# Altium schematic sheet 3-camera.SchDoc
size A4; SheetNumber: 3; SheetTotal: 4
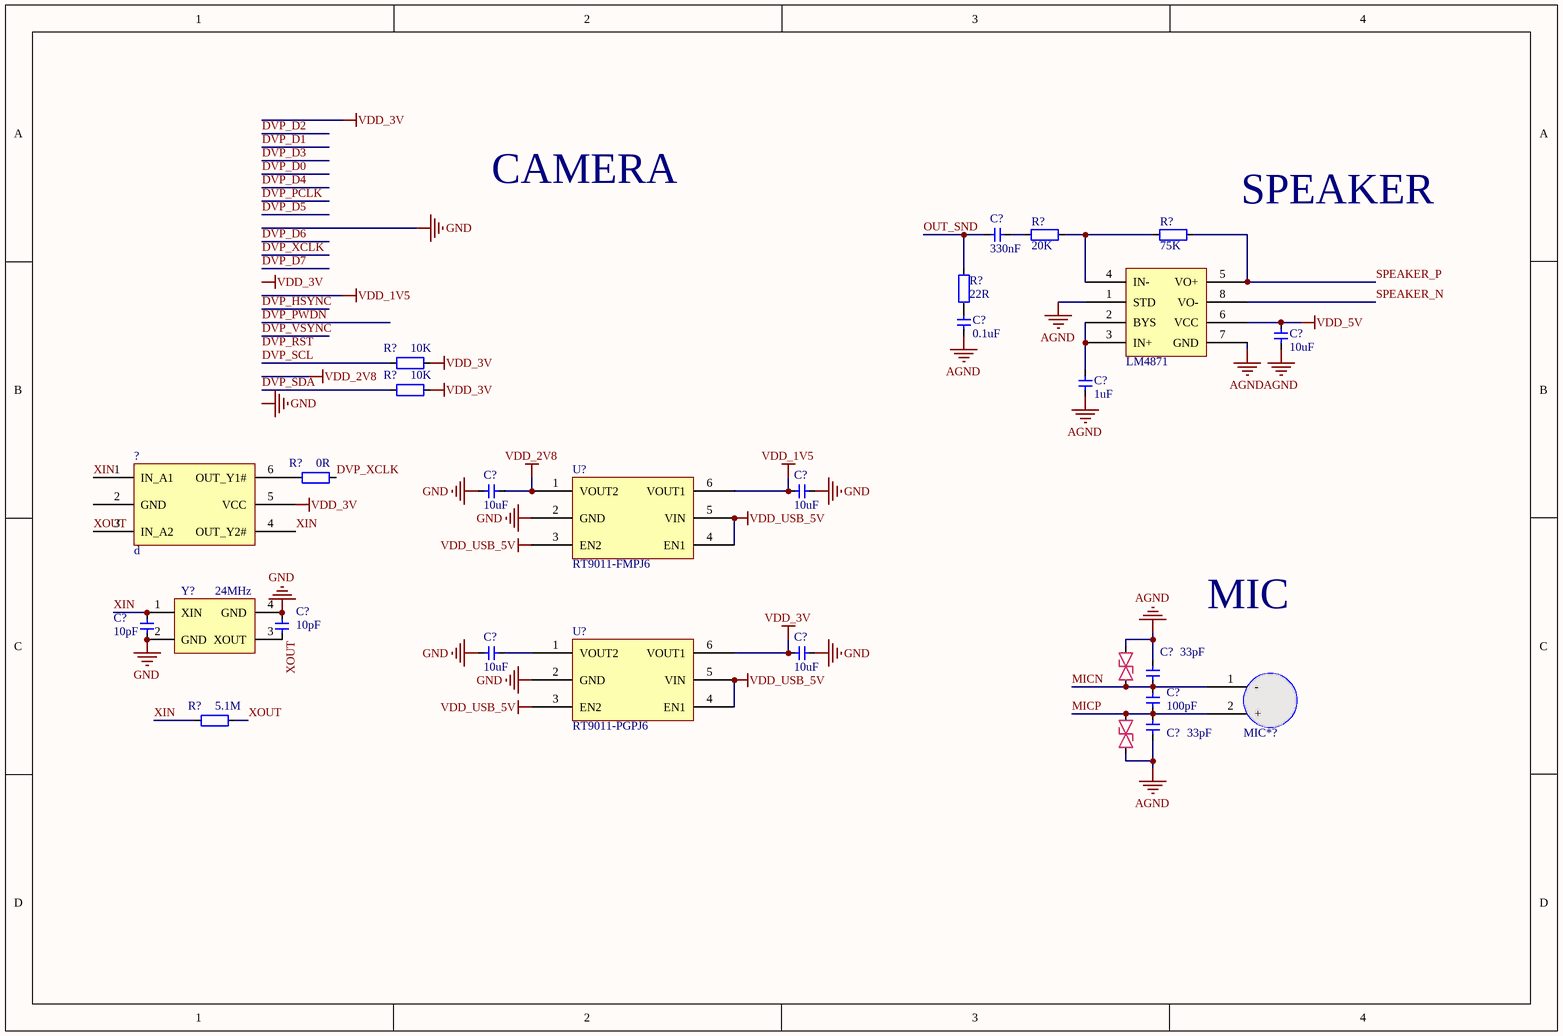
[diagram p0: 3-camera.SchDoc]

## Parts
(Parts that share a designator on the sheet are numbered #1, #2 ... from top to bottom, then left to right.)
*?  LM4871  [MSOP-8]
?  d  [SOT363-6]
C?#1  330nF  [0603-CAP]
C?#2  0.1uF  [CAP_0402]
C?#3  10uF  [CAP_0402]
C?#4  1uF  [CAP_0402]
C?#5  10uF  [CAP_0402]
C?#6  10uF  [CAP_0402]
C?#7  10pF  [CAP_0402]
C?#8  10pF  [CAP_0402]
C?#9  10uF  [CAP_0402]
C?#10  10uF  [CAP_0402]
C?#11  33pF  [CAP_0402]
C?#12  100pF  [CAP_0402]
C?#13  33pF  [CAP_0402]
ESD-?#1  ESD-0402  [ESD-0402]  (value not drawn)
ESD-?#2  ESD-0402  [ESD-0402]  (value not drawn)
MIC*?  MIC*  [MIC-0416]  (value not drawn)
R?#1  20K  [RES_0402]
R?#2  75K  [RES_0402]
R?#3  22R  [RES_0402]
R?#4  10K  [RES_0402]
R?#5  10K  [RES_0402]
R?#6  0R  [RES_0402]
R?#7  5.1M  [RES_0402]
U?#1  RT9011-FMPJ6  [SOT23-6]
U?#2  RT9011-PGPJ6  [SOT23-6]
Y?  24MHz  [晶振2520]

## Nets
AGND: *?.1(STD) *?.7(GND) C?#2.1 C?#3.1 C?#4.1 C?#11.1 C?#13.1 ESD-?#1.2 ESD-?#2.1
GND: C?#5.1 C?#6.1 C?#7.1 C?#8.2 C?#9.1 C?#10.1 U?#1.2(GND) U?#2.2(GND) Y?.2(GND) Y?.4(GND)
VDD_1V5: C?#6.2 U?#1.6(VOUT1)
VDD_2V8: C?#5.2 U?#1.1(VOUT2)
VDD_3V: ?.5(VCC) C?#10.2 R?#4.2 R?#5.2 U?#2.6(VOUT1)
VDD_5V: *?.6(VCC) C?#3.2
VDD_USB_5V: U?#1.3(EN2) U?#1.4(EN1) U?#1.5(VIN) U?#2.3(EN2) U?#2.4(EN1) U?#2.5(VIN)
DVP_SCL: R?#4.1
DVP_SDA: R?#5.1
DVP_XCLK: R?#6.2
MICN: C?#11.2 C?#12.2 ESD-?#1.1 MIC*?.1(-)
MICP: C?#12.1 C?#13.2 ESD-?#2.2 MIC*?.2(+)
OUT_SND: C?#1.2 R?#3.2
SPEAKER_N: *?.8(VO-)
SPEAKER_P: *?.5(VO+) R?#2.2
XIN: ?.1(IN_A1) ?.4(OUT_Y2#) C?#7.2 R?#7.1 Y?.1(XIN)
XOUT: ?.3(IN_A2) C?#8.1 R?#7.2 Y?.3(XOUT)
Net*?_2: *?.2(BYS) *?.3(IN+) C?#4.2
Net*?_4: *?.4(IN-) R?#1.2 R?#2.1
Net?_6: ?.6(OUT_Y1#) R?#6.1
NetC?#1_1: C?#1.1 R?#1.1
NetC?#2_2: C?#2.2 R?#3.1
NetC?#9_2: C?#9.2 U?#2.1(VOUT2)

Not connected (* = marked no-connect by the designer): ? 2(GND)

## Notes on the sheet
- CAMERA
- SPEAKER
- MIC
- Labels drawn without touching a wire or pin: DVP_RST, GND, VDD_3V

## Library data of the parts
? = NL27WZU04DF
C?#1 = 电容-0603: Capacitor; Value: 0.1u
C?#2-C?#13 = 电容-0402: Capacitor; Value: 0.1u
ESD-?#1 ESD-?#2 = ESD-0402: ESD
MIC*? = MIC
R?#1 R?#2 R?#4-R?#7 = 电阻-0402: Resistor; Value: 22R
R?#3 = 电阻-0402: Resistor; Value: 22R
U?#1 U?#2 = RT9011
Y? = 晶振-4Pin-无源: 2520无源; MF: ECS International; MP: ECS-3225S30-240-EN-TR; Package: SMD-6 ECS International; Price: 0.75 USD; Availability: Unavailable; Value: *